# EAGLE design WS2811ControlBoard (EAGLE 9.1.0)
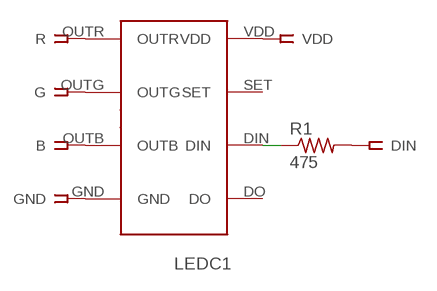
[diagram p0: schematic, sheet 1]

## Parts
B  SSW-101-02-G-S  [SSW-101-02-G-S]
DIN  SSW-101-02-G-S  [SSW-101-02-G-S]
G  SSW-101-02-G-S  [SSW-101-02-G-S]
GND  SSW-101-02-G-S  [SSW-101-02-G-S]
LEDC1  WS2811  [SOP8]
R  SSW-101-02-G-S  [SSW-101-02-G-S]
R1  475  R-US_R0805W  [R0805W]
VDD  SSW-101-02-G-S  [SSW-101-02-G-S]

## Nets
N$1: LEDC1.OUTR R.1
N$2: G.1 LEDC1.OUTG
N$3: B.1 LEDC1.OUTB
N$4: GND.1 LEDC1.GND
N$5: LEDC1.VDD VDD.1
N$6: DIN.1 R1.2
N$7: LEDC1.DIN R1.1
Unconnected: LEDC1.DO LEDC1.SET

## Library data of the parts
B DIN G GND R VDD = con-samtec:SSW-101-02-G-S: THROUGH-HOLE .025" SQ POST SOCKET Source: Samtec SSW.pdf; MF: Samtec Inc.; MPN: SSW-101-02-G-S; OC_FARNELL: unknown; OC_NEWARK: 11P9336
LEDC1 = ws2811:WS2811
R1 = resistor:R-US_: RESISTOR, American symbol

## Board
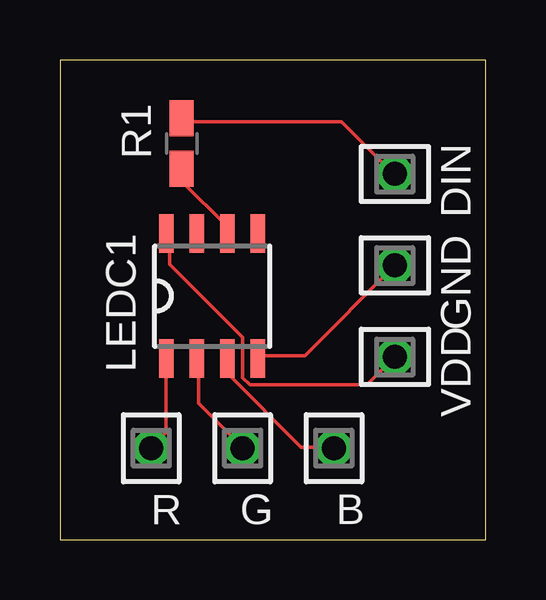
[diagram p1: board, top side]

Size 17.76 x 19.99 mm. Coordinates in mm from the lower left corner, seen from the top.
Outline: 0,0 17.76,0 17.76,19.99 0,19.99 0,0
Copper layers (1*16): Top 0.035mm / dielectric 1.5mm / Bottom 0.035mm
Design rules "default": minimum track width 6mil, minimum drill 0.35mm, track to track 6mil, track to pad 6mil, pad to pad 6mil, via to via 6mil, smd to smd 6mil, copper to edge 40mil, drill to drill 6mil, minimum pad ring 10mil, minimum via ring 8mil, stop-mask expansion 4mil, vias tented up to drill 0mil, thermal gap 10mil

### Footprints (pad centres in the part's own frame; a part is rotated, then mirrored left to right if it is on the bottom)
SSW-101-02-G-S = drill 1 pad 1.5 octagon: 1 0,0
SOP8 = smd 0.6 x 1.6: DIN 0.635,2.6; DO 1.905,2.6; GND 1.905,-2.6; OUTB 0.635,-2.6; OUTG -0.635,-2.6; OUTR -1.905,-2.6; SET -0.635,2.6; VDD -1.905,2.6
R0805W = smd 1.5 x 1: 1 -1.052,0; 2 1.052,0

### Placement (x,y rotation side)
B  11.43,3.81 90 top
DIN  13.97,15.24 180 top
G  7.62,3.81 90 top
GND  13.97,11.43 180 top
LEDC1  6.35,10.16 0 top
R  3.81,3.81 90 top
R1  5.08,16.51 90 top
VDD  13.97,7.62 180 top

### Tracks (layer width: path | path; a pad name or v marks a point on that pad's centre or on a via)
N$1
  Top 0.152: LEDC1.OUTR 4.42,7.52 4.42,4.47 3.81,3.86 R.1
N$2
  Top 0.152: LEDC1.OUTG 5.79,7.52 5.79,5.69 7.62,3.86 G.1
N$3
  Top 0.152: LEDC1.OUTB 7.01,7.52 7.01,6.91 10.06,3.86 11.43,3.86 B.1
N$4
  Top 0.152: GND.1 10.21,7.67 8.38,7.67 LEDC1.GND
N$5
  Top 0.152: VDD.1 12.8,6.45 7.92,6.45 7.62,6.76 7.62,8.43 4.57,11.48 4.57,12.7 LEDC1.VDD
N$6
  Top 0.152: R1.2 5.18,17.42 11.73,17.42 13.87,15.29 DIN.1
N$7
  Top 0.152: R1.1 5.18,15.44 5.18,14.83 6.86,13.16 6.86,12.85 LEDC1.DIN